# EAGLE design openDrive_MC_00.03 (EAGLE 5.10)
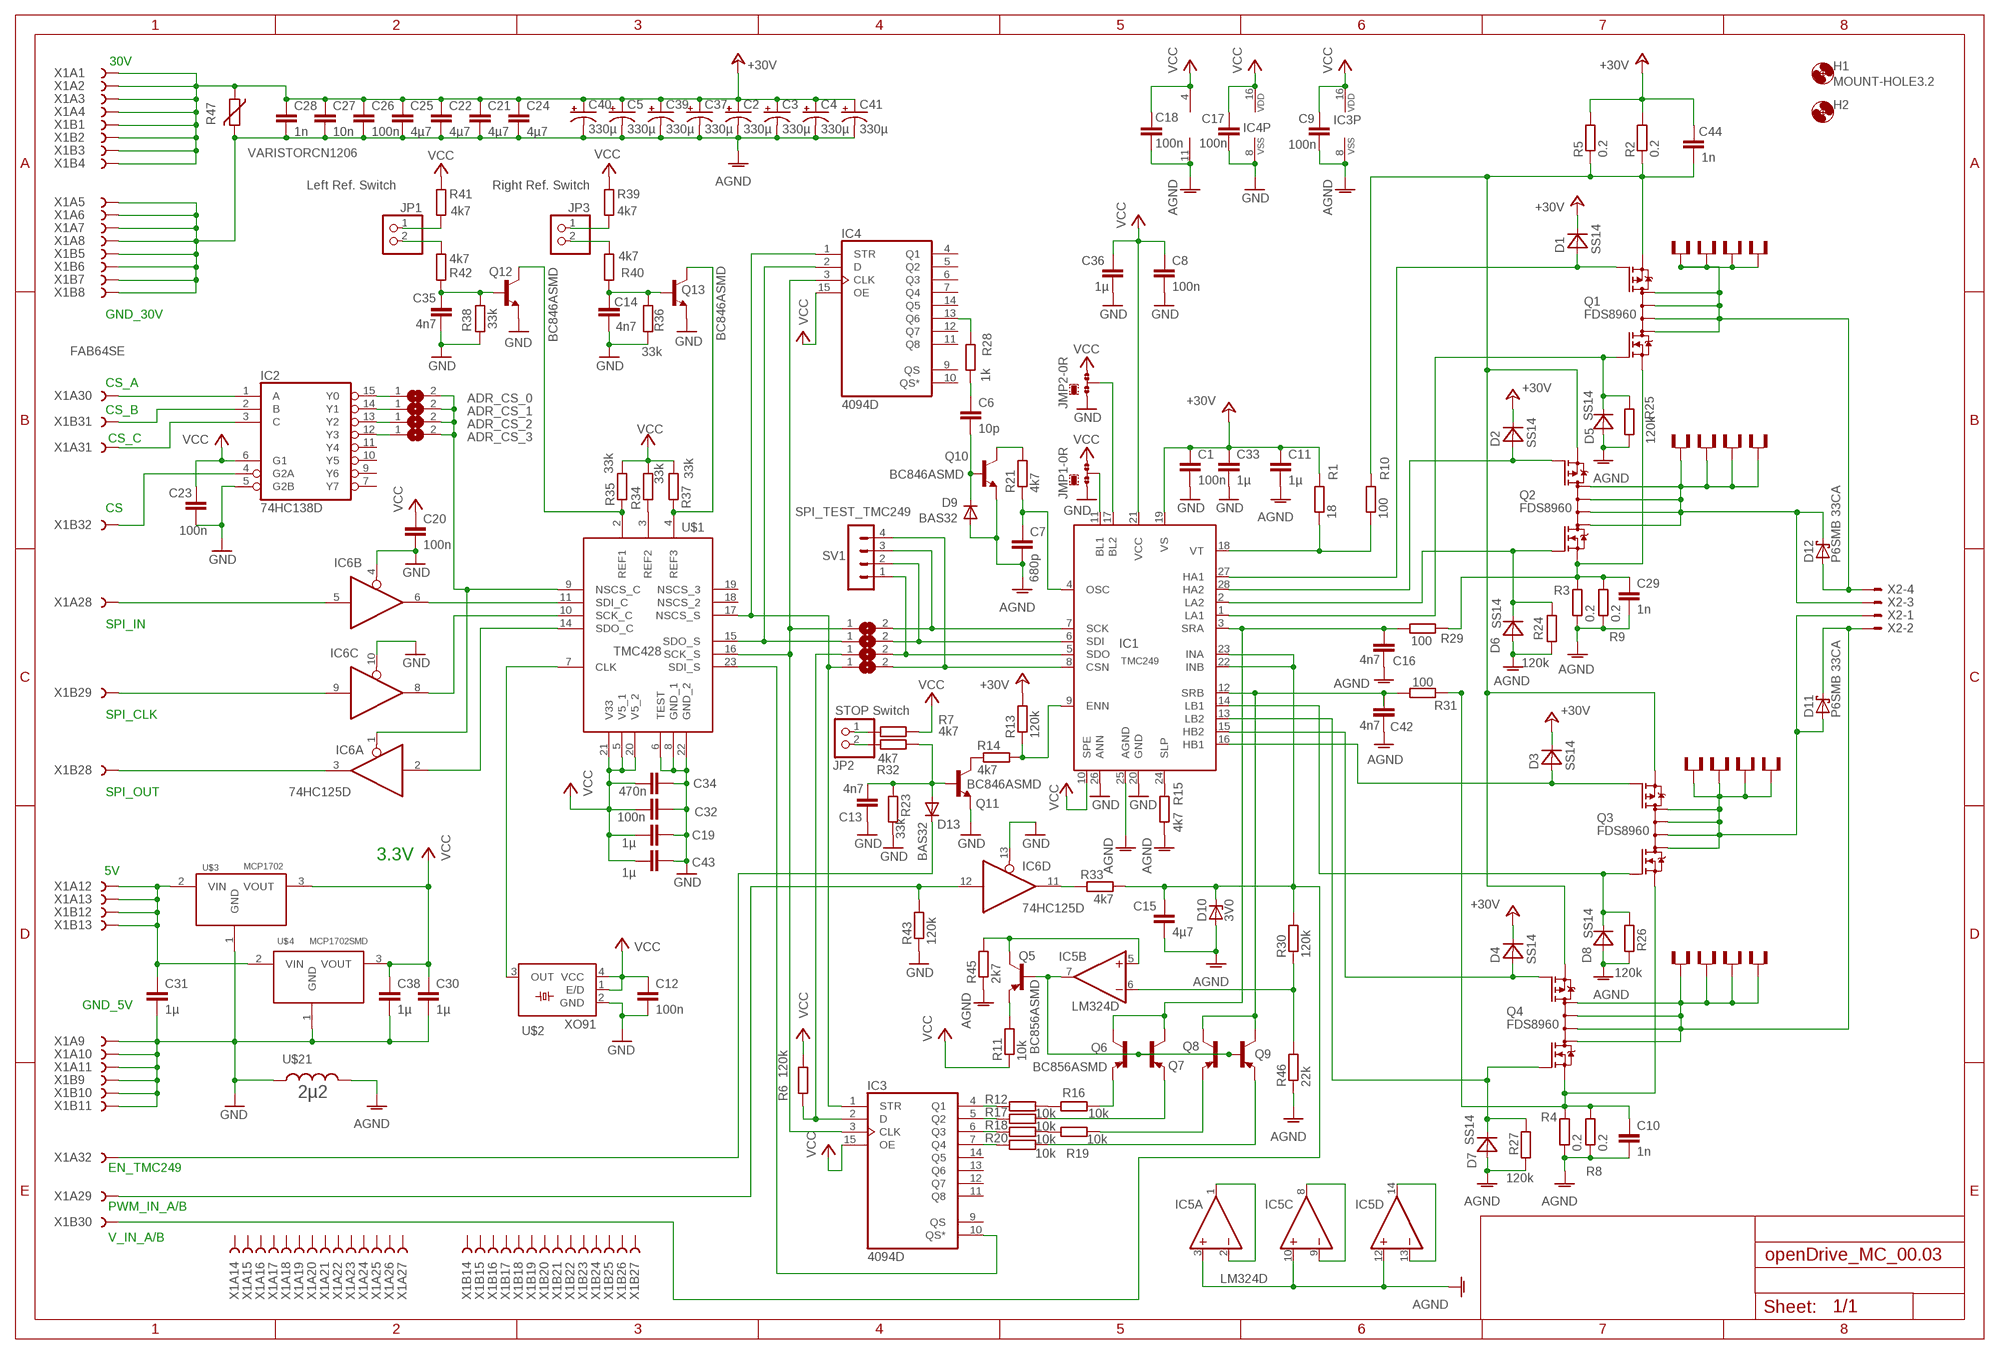
[diagram p0: schematic, sheet 1]

## Parts
C1  100n  C-EUC1206  [C1206]
C2  330µ  CAP_POLG  [PANASONIC_G]
C3  330µ  CAP_POLG  [PANASONIC_G]
C4  330µ  CAP_POLG  [PANASONIC_G]
C5  330µ  CAP_POLG  [PANASONIC_G]
C6  10p  C-EUC1206  [C1206]
C7  680p  C-EUC1206  [C1206]
C8  100n  C-EUC1206  [C1206]
C9  100n  C-EUC1206  [C1206]
C10  1n  C-EUC1206  [C1206]
C11  1µ  C-EUC1206  [C1206]
C12  100n  C-EUC1206  [C1206]
C13  4n7  C-EUC1206  [C1206]
C14  4n7  C-EUC1206  [C1206]
C15  4µ7  C-EUC1206  [C1206]
C16  4n7  C-EUC1206  [C1206]
C17  100n  C-EUC1206  [C1206]
C18  100n  C-EUC1206  [C1206]
C19  1µ  C-EUC1206  [C1206]
C20  100n  C-EUC1206  [C1206]
C21  4µ7  C-EUC1206  [C1206]
C22  4µ7  C-EUC1206  [C1206]
C23  100n  C-EUC1206  [C1206]
C24  4µ7  C-EUC1206  [C1206]
C25  4µ7  C-EUC1206  [C1206]
C26  100n  C-EUC1206  [C1206]
C27  10n  C-EUC1206  [C1206]
C28  1n  C-EUC1206  [C1206]
C29  1n  C-EUC1206  [C1206]
C30  1µ  C-EUC1206  [C1206]
C31  1µ  C-EUC1206  [C1206]
C32  100n  C-EUC1206  [C1206]
C33  1µ  C-EUC1206  [C1206]
C34  470n  C-EUC1206  [C1206]
C35  4n7  C-EUC1206  [C1206]
C36  1µ  C-EUC1206  [C1206]
C37  330µ  CAP_POLG  [PANASONIC_G]
C38  1µ  C-EUC1206  [C1206]
C39  330µ  CAP_POLG  [PANASONIC_G]
C40  330µ  CAP_POLG  [PANASONIC_G]
C41  330µ  CAP_POLG  [PANASONIC_G]
C42  4n7  C-EUC1206  [C1206]
C43  1µ  C-EUC1206  [C1206]
C44  1n  C-EUC1206  [C1206]
D1  SS14  MBRA340T3  [SMA]
D2  SS14  MBRA340T3  [SMA]
D3  SS14  MBRA340T3  [SMA]
D4  SS14  MBRA340T3  [SMA]
D5  SS14  MBRA340T3  [SMA]
D6  SS14  MBRA340T3  [SMA]
D7  SS14  MBRA340T3  [SMA]
D8  SS14  MBRA340T3  [SMA]
D9  BAS32  DIODE-SOD80C  [SOD80C]
D10  3V0  ZENER-DIODESOD80C  [SOD80C]
D11  P6SMB 33CA  MBRS130LT3  [SMB]
D12  P6SMB 33CA  MBRS130LT3  [SMB]
D13  BAS32  DIODE-SOD80C  [SOD80C]
H1  MOUNT-HOLE3.2  [3,2]
H2  MOUNT-HOLE3.2  [3,2]
IC1  TMC249  TMC239  [SO28W]
IC2  74HC138D  [SO16]
IC3  4094D  [SO16]
IC4  4094D  [SO16]
IC5  LM324D  [SO14]
IC6  74HC125D  [SO14]
JMP1  0R-JUMPB  [B0R-JMP]
JMP2  0R-JUMPB  [B0R-JMP]
JP1  Left Ref. Switch  PINHD-1X2  [1X02]
JP2  STOP Switch  PINHD-1X2  [1X02]
JP3  Right Ref. Switch  PINHD-1X2  [1X02]
Q1  FDS8960  IRF7389  [SO08-IRF]
Q2  FDS8960  IRF7389  [SO08-IRF]
Q3  FDS8960  IRF7389  [SO08-IRF]
Q4  FDS8960  IRF7389  [SO08-IRF]
Q5  BC856ASMD  [SOT23-BEC]
Q6  BC856ASMD  [SOT23-BEC]
Q7  BC856ASMD  [SOT23-BEC]
Q8  BC856ASMD  [SOT23-BEC]
Q9  BC856ASMD  [SOT23-BEC]
Q10  BC846ASMD  [SOT23]
Q11  BC846ASMD  [SOT23]
Q12  BC846ASMD  [SOT23]
Q13  BC846ASMD  [SOT23]
R1  18  R-EU_M1206  [M1206]
R2  0.2  R-EU_R2010  [R2010]
R3  0.2  R-EU_R2010  [R2010]
R4  0.2  R-EU_R2010  [R2010]
R5  0.2  R-EU_R2010  [R2010]
R6  120k  R-EU_M1206  [M1206]
R7  4k7  R-EU_M1206  [M1206]
R8  0.2  R-EU_R2010  [R2010]
R9  0.2  R-EU_R2010  [R2010]
R10  100  R-EU_M1206  [M1206]
R11  10k  R-EU_M1206  [M1206]
R12  10k  R-EU_M1206  [M1206]
R13  120k  R-EU_M1206  [M1206]
R14  4k7  R-EU_M1206  [M1206]
R15  4k7  R-EU_M1206  [M1206]
R16  10k  R-EU_M1206  [M1206]
R17  10k  R-EU_M1206  [M1206]
R18  10k  R-EU_M1206  [M1206]
R19  10k  R-EU_M1206  [M1206]
R20  10k  R-EU_M1206  [M1206]
R21  4k7  R-EU_M1206  [M1206]
R23  33k  R-EU_M1206  [M1206]
R24  120k  R-EU_M1206  [M1206]
R25  120k  R-EU_M1206  [M1206]
R26  120k  R-EU_M1206  [M1206]
R27  120k  R-EU_M1206  [M1206]
R28  1k  R-EU_M1206  [M1206]
R29  100  R-EU_M1206  [M1206]
R30  120k  R-EU_M1206  [M1206]
R31  100  R-EU_M1206  [M1206]
R32  4k7  R-EU_M1206  [M1206]
R33  4k7  R-EU_M1206  [M1206]
R34  33k  R-EU_M1206  [M1206]
R35  33k  R-EU_M1206  [M1206]
R36  33k  R-EU_M1206  [M1206]
R37  33k  R-EU_M1206  [M1206]
R38  33k  R-EU_M1206  [M1206]
R39  4k7  R-EU_M1206  [M1206]
R40  4k7  R-EU_M1206  [M1206]
R41  4k7  R-EU_M1206  [M1206]
R42  4k7  R-EU_M1206  [M1206]
R43  120k  R-EU_M1206  [M1206]
R45  2k7  R-EU_M1206  [M1206]
R46  22k  R-EU_M1206  [M1206]
R47  VARISTORCN1206  [CT/CN1206]
SJ1  ADR_CS_0  SJ  [SJ]
SJ2  ADR_CS_1  SJ  [SJ]
SJ3  ADR_CS_2  SJ  [SJ]
SJ4  ADR_CS_3  SJ  [SJ]
SJ5  SJ  [SJ]
SJ6  SJ  [SJ]
SJ7  SJ  [SJ]
SJ8  SJ  [SJ]
SV1  SPI_TEST_TMC249  MA04-1  [MA04-1]
U$1  TMC428  [SOP24]
U$2  XO91  [XO91]
U$3  MCP1702  [TO92]
U$4  MCP1702SMD  [SOT89]
U$5  PIN1  [PAD]
U$6  PIN1  [PAD]
U$7  PIN1  [PAD]
U$8  PIN1  [PAD]
U$9  PIN1  [PAD]
U$10  PIN1  [PAD]
U$11  PIN1  [PAD]
U$12  PIN1  [PAD]
U$13  PIN1  [PAD]
U$14  PIN1  [PAD]
U$15  PIN1  [PAD]
U$16  PIN1  [PAD]
U$17  PIN1  [PAD]
U$18  PIN1  [PAD]
U$19  PIN1  [PAD]
U$20  PIN1  [PAD]
U$21  2µ2  INDUCTOR1210  [1210]
X1  FAB64SE  [FAB64S]
X2  AKL18X-04W  [AKL182-04]

## Nets
+30V: C1.1 C2.+ C3.+ C4.+ C5.+ C11.1 C21.1 C22.1 C24.1 C25.1 C26.1 C27.1 C28.1 C33.1 C37.+ C39.+ C40.+ C41.+ C44.1 D1.C D2.C D3.C D4.C IC1.19(VS) R1.2 R2.2 R5.2 R13.2 R47.1 X1.A1 X1.A2 X1.A3 X1.A4 X1.B1 X1.B2 X1.B3 X1.B4
AGND: C2.- C3.- C4.- C5.- C7.2 C9.2 C10.2 C11.2 C15.2 C16.2 C18.2 C21.2 C22.2 C24.2 C25.2 C26.2 C27.2 C28.2 C29.2 C37.- C39.- C40.- C41.- C42.2 D5.A D6.A D7.A D8.A D9.A D10.A IC1.25(AGND) IC3.8(VSS) IC5.3(A:+IN) IC5.10(C:+IN) IC5.11(P:V-) IC5.12(D:+IN) Q10.2(E) R3.1 R4.1 R8.1 R9.1 R15.1 R24.1 R25.1 R26.1 R27.1 R45.1 R46.1 R47.2 U$21.2 X1.A5 X1.A6 X1.A7 X1.A8 X1.B5 X1.B6 X1.B7 X1.B8
GND: C1.2 C8.2 C12.2 C13.2 C14.2 C17.2 C19.2 C20.2 C23.2 C30.2 C31.2 C32.2 C33.2 C34.2 C35.2 C36.2 C38.2 C43.2 IC1.20(GND) IC1.26(ANN) IC2.5(G2B) IC4.8(VSS) IC6.4(B:OE) IC6.10(C:OE) IC6.13(D:OE) JMP1.3 JMP2.3 Q11.2(E) Q12.2(E) Q13.2(E) R23.1 R36.1 R38.1 R43.1 U$1.6(TEST) U$1.8(GND_1) U$1.22(GND_2) U$2.2(GND) U$3.1(GND) U$4.1(GND) U$21.1 X1.A9 X1.A10 X1.A11 X1.B9 X1.B10 X1.B11
N$1: D4.A IC1.15(HB2) Q4.4(P-G)
N$2: U$1.7(CLK) U$2.3(OUT)
N$3: D3.A IC1.16(HB1) Q3.4(P-G)
N$4: IC6.5(B:I) X1.A28
N$5: D11.C Q4.5(D) Q4.6(D) Q4.7(D) Q4.8(D) U$17.1 U$18.1 U$19.1 U$20.1 X2.P$2
N$6: C29.1 Q1.1(N-S) Q2.1(N-S) R3.2 R9.2 R29.2
N$7: D11.A Q3.5(D) Q3.6(D) Q3.7(D) Q3.8(D) U$13.1 U$14.1 U$15.1 U$16.1 X2.P$1
N$8: D2.A IC1.28(HA2) Q2.4(P-G)
N$9: D12.C Q2.5(D) Q2.6(D) Q2.7(D) Q2.8(D) U$9.1 U$10.1 U$11.1 U$12.1 X2.P$3
N$10: D5.C IC1.1(LA1) Q1.2(N-G) R25.2
N$11: D1.A IC1.27(HA1) Q1.4(P-G)
N$12: D12.A Q1.5(D) Q1.6(D) Q1.7(D) Q1.8(D) U$5.1 U$6.1 U$7.1 U$8.1 X2.P$4
N$13: D6.C IC1.2(LA2) Q2.2(N-G) R24.2
N$14: C7.1 IC1.4(OSC) R21.1
N$15: D7.C IC1.13(LB2) Q4.2(N-G) R27.2
N$16: C15.1 D10.C IC1.22(INB) IC1.23(INA) R30.2 R33.2 X1.B30
N$17: IC1.18(VT) R1.1 R10.1
N$18: IC5.6(B:-IN) R30.1 R46.2
N$19: IC1.7(SCK) SJ5.2 SV1.3
N$20: C16.1 IC1.3(SRA) Q6.C Q7.C R29.1
N$21: Q6.E R16.2
N$22: C42.1 IC1.12(SRB) Q8.C Q9.C R31.1
N$23: Q7.E R17.2
N$24: IC1.11(BL1) JMP1.2
N$25: IC5.7(B:OUT) Q5.B Q6.B Q7.B Q8.B Q9.B
N$26: Q8.E R19.2
N$27: Q9.E R20.2
N$28: IC1.24(SLP) R15.2
N$29: R12.2 R16.1
N$30: R18.2 R19.1
N$31: IC3.4(Q1) R12.1
N$32: IC3.5(Q2) R17.1
N$33: IC3.6(Q3) R18.1
N$34: IC3.7(Q4) R20.1
N$35: IC4.2(D) SJ6.1 U$1.15(SDO_S)
N$36: IC3.3(CLK) IC4.3(CLK) SJ5.1 U$1.16(SCK_S)
N$37: IC3.1(STR) IC4.1(STR) SJ8.1 U$1.17(NSCS_S)
N$38: IC3.10(QS*) U$1.23(SDI_S)
N$39: IC3.2(D) R6.1 SJ7.1
N$40: IC1.17(BL2) JMP2.2
N$41: IC6.9(C:I) X1.B29
N$42: C44.2 Q1.3(P-S) Q2.3(P-S) Q3.3(P-S) Q4.3(P-S) R2.1 R5.1 R10.2
N$43: JP2.1 R7.1
N$44: JP2.2 R32.2
N$45: D8.C IC1.14(LB1) Q3.2(N-G) R26.2
N$46: IC6.2(A:I) U$1.14(SDO_C)
N$47: Q10.3(C) R21.2
N$48: Q11.3(C) R14.1
N$49: C6.2 D9.C Q10.1(B)
N$50: IC5.1(A:OUT) IC5.2(A:-IN)
N$51: IC4.13(Q6) R28.2
N$52: C6.1 R28.1
N$53: IC5.8(C:OUT) IC5.9(C:-IN)
N$54: IC5.13(D:-IN) IC5.14(D:OUT)
N$55: IC6.11(D:O) R33.1
N$56: IC1.9(ENN) R13.1 R14.2
N$57: IC5.5(B:+IN) Q5.C R45.2
N$58: IC6.8(C:O) U$1.10(SCK_C)
N$59: Q5.E R11.2
N$60: IC6.6(B:O) U$1.11(SDI_C)
N$61: IC6.1(A:OE) SJ1.2 SJ2.2 SJ3.2 SJ4.2 U$1.9(NSCS_C)
N$62: IC2.15(Y0) SJ1.1
N$63: IC2.14(Y1) SJ2.1
N$64: IC2.13(Y2) SJ3.1
N$65: IC2.12(Y3) SJ4.1
N$66: IC2.2(B) X1.B31
N$67: IC2.4(G2A) X1.B32
N$68: IC2.3(C) X1.A31
N$69: IC2.1(A) X1.A30
N$72: IC6.3(A:O) X1.B28
N$73: IC6.12(D:I) R43.2 X1.A29
N$74: C13.1 D13.A Q11.1(B) R23.2 R32.1
N$75: C31.1 U$3.2(VIN) U$4.2(VIN) X1.A12 X1.A13 X1.B12 X1.B13
N$76: D13.C X1.A32
N$77: Q12.3(C) R35.1 U$1.2(REF1)
N$78: R34.1 U$1.3(REF2)
N$79: Q13.3(C) R37.1 U$1.4(REF3)
N$82: C35.1 Q12.1(B) R38.2 R42.1
N$83: JP1.2 R42.2
N$84: JP1.1 R41.1
N$85: C14.1 Q13.1(B) R36.2 R40.1
N$86: JP3.2 R40.2
N$87: JP3.1 R39.1
N$88: IC1.6(SDI) SJ6.2 SV1.2
N$89: IC1.5(SDO) SJ7.2 SV1.1
N$90: IC1.8(CSN) SJ8.2 SV1.4
N$91: C10.1 Q3.1(N-S) Q4.1(N-S) R4.2 R8.2 R31.2
VCC: C8.1 C9.1 C12.1 C17.1 C18.1 C19.1 C20.1 C23.1 C30.1 C32.1 C34.1 C36.1 C38.1 C43.1 IC1.10(SPE) IC1.21(VCC) IC2.6(G1) IC3.15(OE) IC3.16(VDD) IC4.15(OE) IC4.16(VDD) IC5.4(P:V+) JMP1.1 JMP2.1 R6.2 R7.2 R11.1 R34.2 R35.2 R37.2 R39.2 R41.2 U$1.5(V5_1) U$1.20(V5_2) U$1.21(V33) U$2.1(E/D) U$2.4(VCC) U$3.3(VOUT) U$4.3(VOUT)
Unconnected: IC2.7(Y7) IC2.9(Y6) IC2.10(Y5) IC2.11(Y4) IC3.9(QS) IC3.11(Q8) IC3.12(Q7) IC3.13(Q6) IC3.14(Q5) IC4.4(Q1) IC4.5(Q2) IC4.6(Q3) IC4.7(Q4) IC4.9(QS) IC4.10(QS*) IC4.11(Q8) IC4.12(Q7) IC4.14(Q5) U$1.18(NSCS_2) U$1.19(NSCS_3) X1.A14 X1.A15 X1.A16 X1.A17 X1.A18 X1.A19 X1.A20 X1.A21 X1.A22 X1.A23 X1.A24 X1.A25 X1.A26 X1.A27 X1.B14 X1.B15 X1.B16 X1.B17 X1.B18 X1.B19 X1.B20 X1.B21 X1.B22 X1.B23 X1.B24 X1.B25 X1.B26 X1.B27

## Notes on the sheet
- 30V
- GND_30V
- CS_A
- CS_B
- CS_C
- CS
- SPI_IN
- SPI_CLK
- SPI_OUT
- 3.3V
- 5V
- GND_5V
- EN_TMC249
- PWM_IN_A/B
- V_IN_A/B

## Power pins joined to a net without a drawn wire
GND: IC2.8(GND) IC6.7(P:GND)
VCC: IC2.16(VCC) IC6.14(P:VCC)

## Library data of the parts
C1 C6-C36 C38 C42-C44 = rcl:C-EU: CAPACITOR, European symbol
C2-C5 C37 C39-C41 = SparkFun:CAP_POL: Capacitor Polarized These are standard SMD and PTH capacitors. Normally 10uF, 47uF, and 100uF in electrolytic and tantalum varieties. Always verify the external diameter of the through hole cap, it varies with capacity, voltage, and manufacturer. The EIA devices should be standard.
D1-D8 = diode:MBRA340T3: Surface Mount Schottky Power Rectifier Source: http://www.onsemi.com/pub_link/Collateral/MBRA340T3-D.PDF
D9 D13 = diode:DIODE-: DIODE
D10 = diode:ZENER-DIODE: Z-Diode
D11 D12 = diode:MBRS130LT3: Schottky Power Rectifier Source: http://www.onsemi.com/pub/Collateral/MBRS130LT3-D.PDF
H1 H2 = holes:MOUNT-HOLE: MOUNTING HOLE with drill center marker
IC1 = tmc:TMC239: TMC239 Stepper Motor Driver - up to 4A, w. protection and diagnostics
IC2 = 74xx-eu:74*138: 3-line to 8-line DECODER/DEMULTIPLEXER
IC3 IC4 = 40xx:4094: 8-stage SHIFT/STORE REGISTER, tri-state
IC5 = linear:LM324: OP AMP
IC6 = 74xx-eu:74*125: Quad bus BUFFER, 3-state
JMP1 JMP2 = jump-0r-smd:0R-JUMP: SMD 0R 0805 Jumper
JP1-JP3 = pinhead:PINHD-1X2: PIN HEADER
Q1-Q4 = transistor-fet:IRF7389: Complimentary Half Bridge HEXFET Power MOSFET Source: http://www.irf.com/product-info/datasheets/data/irf7389.pdf
Q5-Q9 = transistor-pnp:BC856*: PNP Transistror
Q10-Q13 = transistor-npn:BC846*: NPN Transistor
R1-R21 R23-R43 R45 R46 = rcl:R-EU_: RESISTOR, European symbol
R47 = varistor:VARISTOR: VARISTOR
SJ1-SJ8 = jumper:SJ: SMD solder JUMPER
SV1 = con-lstb:MA04-1: PIN HEADER
U$1 = tmc428:TMC428
U$2 = euroquartz:XO91
U$3 U$4 = mcp1702:MCP1702
U$5-U$20 = con-faston:PIN1
U$21 = SparkFun:INDUCTOR: Inductors Basic Inductor/Choke - 0603 and 1206. Footprints are not proven and vary greatly between part numbers.
X1 = con-vg:FAB64SE: CONNECTOR female, 64 pins, single, type B, rows AB, grid 2.54 mm
X2 = con-riacon_akl:AKL18X-04: Riacon AKL18X Steckverbinder 4-Pol Grid = 3,5mm

## Board
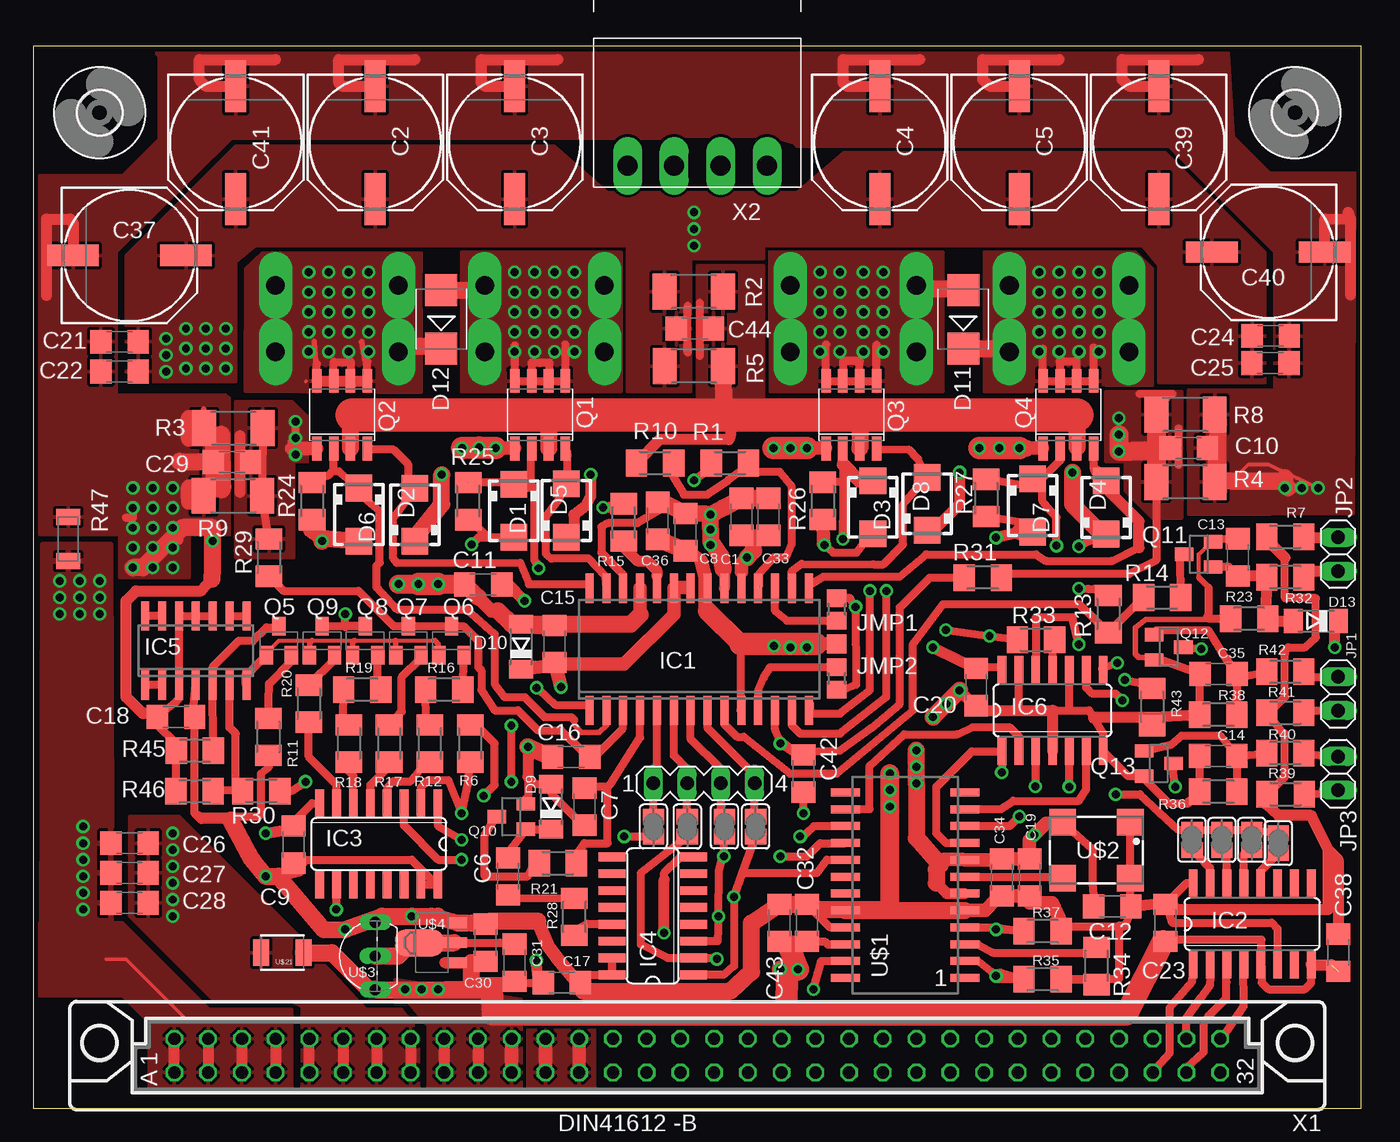
[diagram p1: board, top side]
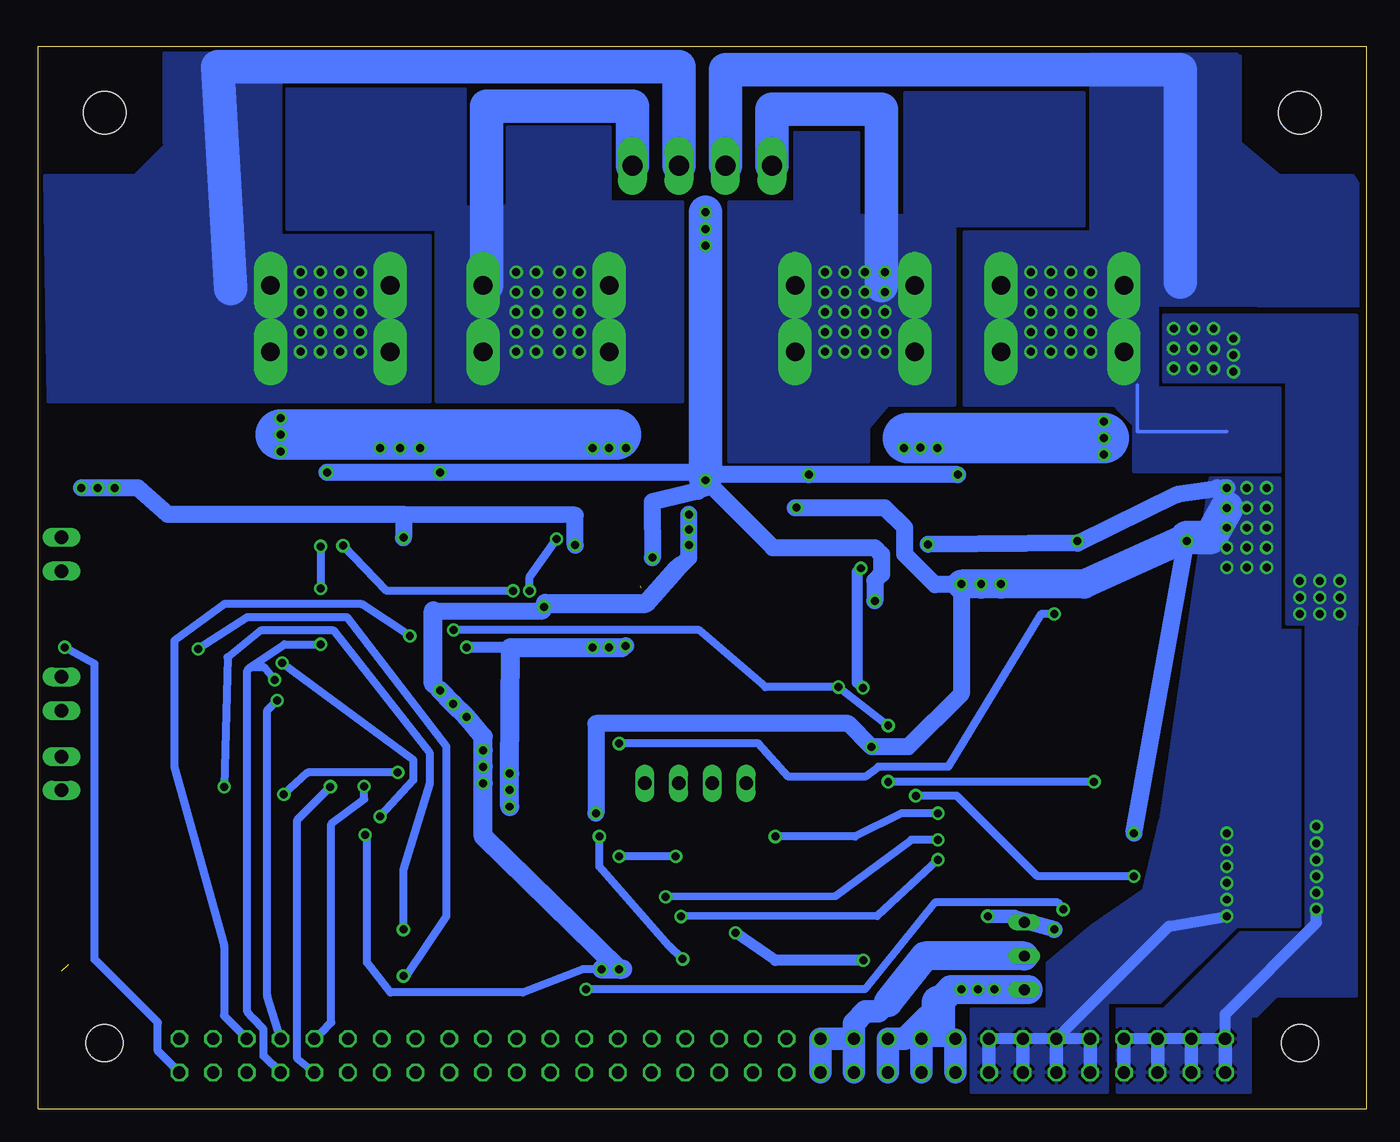
[diagram p2: board, bottom side, seen from below]

Size 100 x 80 mm. Coordinates in mm from the lower left corner, seen from the top.
Outline: 100,0 100,80 0,80 0,0 100,0
Copper layers (1*16): Top 0.035mm / dielectric 1.5mm / Bottom 0.035mm
Design rules "ZWILLING": minimum track width 0.2mm, minimum drill 0.5mm, track to track 0.2mm, track to pad 0.2mm, pad to pad 0.15mm, via to via 0.2mm, smd to smd 0mil, copper to edge 0.2mm, drill to drill 0.2mm, minimum pad ring 0.2mm, minimum via ring 0.2mm, stop-mask expansion 0.1mm, vias tented up to drill 0mil, thermal gap 10mil

### Footprints (pad centres in the part's own frame; a part is rotated, then mirrored left to right if it is on the bottom)
C1206 = smd 1.6 x 1.8: 1 -1.4,0; 2 1.4,0
PANASONIC_G = smd 3.9 x 1.6: + 4.25,0; - -4.25,0
SMA = smd 2 x 2: A 2,0; C -2,0
SOD80C = smd 1.4 x 1.8: A 1.7,0; C -1.7,0
SMB = smd 2.4 x 2.4: A 2.2,0; C -2.2,0
3,2 = hole 3.2: 0,0
SO28W = smd 0.6 x 2.2: 1 -8.255,-4.6; 2 -6.985,-4.6; 3 -5.715,-4.6; 4 -4.445,-4.6; 5 -3.175,-4.6; 6 -1.905,-4.6; 7 -0.635,-4.6; 8 0.635,-4.6; 9 1.905,-4.6; 10 3.175,-4.6; 11 4.445,-4.6; 12 5.715,-4.6; 13 6.985,-4.6; 14 8.255,-4.6; 15 8.255,4.6; 16 6.985,4.6; 17 5.715,4.6; 18 4.445,4.6; 19 3.175,4.6; 20 1.905,4.6; 21 0.635,4.6; 22 -0.635,4.6; 23 -1.905,4.6; 24 -3.175,4.6; 25 -4.445,4.6; 26 -5.715,4.6; 27 -6.985,4.6; 28 -8.255,4.6
SO16 = smd 0.66 x 2.032: 1 -4.445,-3.073; 2 -3.175,-3.073; 3 -1.905,-3.073; 4 -0.635,-3.073; 5 0.635,-3.073; 6 1.905,-3.073; 7 3.175,-3.073; 8 4.445,-3.073; 9 4.445,3.073; 10 3.175,3.073; 11 1.905,3.073; 12 0.635,3.073; 13 -0.635,3.073; 14 -1.905,3.073; 15 -3.175,3.073; 16 -4.445,3.073
SO14 = smd 0.6 x 2.2: 1 -3.81,-2.6; 2 -2.54,-2.6; 3 -1.27,-2.6; 4 0,-2.6; 5 1.27,-2.6; 6 2.54,-2.6; 7 3.81,-2.6; 8 3.81,2.6; 9 2.54,2.6; 10 1.27,2.6; 11 0,2.6; 12 -1.27,2.6; 13 -2.54,2.6; 14 -3.81,2.6
SO14' = smd 0.66 x 2.032: 1 -3.81,-3.073; 2 -2.54,-3.073; 3 -1.27,-3.073; 4 0,-3.073; 5 1.27,-3.073; 6 2.54,-3.073; 7 3.81,-3.073; 8 3.81,3.073; 9 2.54,3.073; 10 1.27,3.073; 11 0,3.073; 12 -1.27,3.073; 13 -2.54,3.073; 14 -3.81,3.073
B0R-JMP = smd 1.5 x 1.3: 1 0,1.7; 2 0,0; 3 0,-1.7
1X02 = drill 1.016 long: 1 -1.27,0; 2 1.27,0
SO08-IRF = smd 0.72 x 1.78: 1 -1.905,-2.543; 2 -0.635,-2.543; 3 0.635,-2.543; 4 1.905,-2.543; 5 1.905,2.543; 6 0.635,2.543; 7 -0.635,2.543; 8 -1.905,2.543
SOT23-BEC = smd 1 x 1.4: B -0.95,-1.1; C 0,1.1; E 0.95,-1.1
SOT23 = smd 1 x 1.4: 1 -0.95,-1.1; 2 0.95,-1.1; 3 0,1.1
M1206 = smd 1.6 x 2: 1 -1.4,0; 2 1.4,0
R2010 = smd 1.8 x 2.7: 1 -2.2,0; 2 2.2,0
CT/CN1206 = smd 1.2 x 1.8: 1 -1.65,0; 2 1.65,0
SJ = smd 1.168 x 1.6: 1 -0.762,0; 2 0.762,0
MA04-1 = drill 1.016 long: 1 -3.81,0; 2 -1.27,0; 3 1.27,0; 4 3.81,0
SOP24 = smd 0.6 x 2.2: 1 -6.985,-4.5; 2 -5.715,-4.5; 3 -4.445,-4.5; 4 -3.175,-4.5; 5 -1.905,-4.5; 6 -0.635,-4.5; 7 0.635,-4.5; 8 1.905,-4.5; 9 3.175,-4.5; 10 4.445,-4.5; 11 5.715,-4.5; 12 6.985,-4.5; 13 6.985,4.5; 14 5.715,4.5; 15 4.445,4.5; 16 3.175,4.5; 17 1.905,4.5; 18 0.635,4.5; 19 -0.635,4.5; 20 -1.905,4.5; 21 -3.175,4.5; 22 -4.445,4.5; 23 -5.715,4.5; 24 -6.985,4.5
XO91 = smd 2 x 2: 1 -2.61,-2.07; 2 2.49,-2.07; 3 2.49,2.13; 4 -2.61,2.13
TO92 = drill 0.813 long: 1 -2.54,0; 2 0,0; 3 2.54,0
SOT89 = smd 0.8 x 1.4: 1 -1.499,-1.981; 3 1.499,-1.981 | smd 0.8 x 1.9: 2 0,-1.727 | smd 2.032 x 3.65: C@1 0,0.94
PAD = drill 1.4 pad 2.54 long: 1 0,0
1210 = smd 1.2 x 2: 1 -1.6,0; 2 1.6,0
FAB64S = drill 0.914 octagon: A1 -1.27,39.37; A2 -1.27,36.83; A3 -1.27,34.29; A4 -1.27,31.75; A5 -1.27,29.21; A6 -1.27,26.67; A7 -1.27,24.13; A8 -1.27,21.59; A9 -1.27,19.05; A10 -1.27,16.51; A11 -1.27,13.97; A12 -1.27,11.43; A13 -1.27,8.89; A14 -1.27,6.35; A15 -1.27,3.81; A16 -1.27,1.27; A17 -1.27,-1.27; A18 -1.27,-3.81; A19 -1.27,-6.35; A20 -1.27,-8.89; A21 -1.27,-11.43; A22 -1.27,-13.97; A23 -1.27,-16.51; A24 -1.27,-19.05; A25 -1.27,-21.59; A26 -1.27,-24.13; A27 -1.27,-26.67; A28 -1.27,-29.21; A29 -1.27,-31.75; A30 -1.27,-34.29; A31 -1.27,-36.83; A32 -1.27,-39.37; B1 1.27,39.37; B2 1.27,36.83; B3 1.27,34.29; B4 1.27,31.75; B5 1.27,29.21; B6 1.27,26.67; B7 1.27,24.13; B8 1.27,21.59; B9 1.27,19.05; B10 1.27,16.51; B11 1.27,13.97; B12 1.27,11.43; B13 1.27,8.89; B14 1.27,6.35; B15 1.27,3.81; B16 1.27,1.27; B17 1.27,-1.27; B18 1.27,-3.81; B19 1.27,-6.35; B20 1.27,-8.89; B21 1.27,-11.43; B22 1.27,-13.97; B23 1.27,-16.51; B24 1.27,-19.05; B25 1.27,-21.59; B26 1.27,-24.13; B27 1.27,-26.67; B28 1.27,-29.21; B29 1.27,-31.75; B30 1.27,-34.29; B31 1.27,-36.83; B32 1.27,-39.37 | hole 2.794: 0.965,-45.009; 0.965,45.009
AKL182-04 = drill 1.5 pad 2.184 long: P$1 -5.25,0; P$2 -1.75,0; P$3 1.75,0; P$4 5.25,0

### Placement (x,y rotation side)
C1  53.33,44.58 90 top
C2  25.75,72.75 270 top
C3  36.25,72.75 270 top
C4  63.75,72.75 270 top
C5  74.25,72.75 270 top
C6  35.75,17.5 90 top
C7  41.5,22.75 270 top
C8  49.12,43.42 90 top
C9  19.6,19.9 90 top
C10  87,49.75 0 top
C11  33.88,39.48 180 top
C12  81.25,15.25 180 top
C13  90.7,41.52 90 top
C14  89.22,26.57 180 top
C15  39.25,35 90 top
C16  40.5,26.5 180 top
C17  39.8,9.5 180 top
C18  10.75,29.5 180 top
C19  75.03,17.43 90 top
C20  71,31.75 270 top
C21  6.5,57.75 180 top
C22  6.5,55.5 180 top
C23  85.25,14 270 top
C24  93.17,58.2 0 top
C25  93.15,56.15 0 top
C26  7.25,20 0 top
C27  7.25,17.75 0 top
C28  7.25,15.5 0 top
C29  14.97,48.7 180 top
C30  34.08,12.5 270 top
C31  36.25,11 270 top
C32  58.25,14 270 top
C33  55.38,44.58 90 top
C34  72.92,17.43 90 top
C35  89.25,32.75 180 top
C36  47.02,44.27 90 top
C37  7.25,64.25 0 top
C38  98.25,11.75 270 top
C39  84.75,72.75 270 top
C40  93,64.5 180 top
C41  15.25,72.75 270 top
C42  58,25.25 270 top
C43  56.17,14 270 top
C44  49.83,58.75 0 top
D1  40.13,45.05 90 top
D2  28.72,44.72 90 top
D3  67.31,45.56 90 top
D4  80.79,45.28 90 top
D5  36.19,45.03 270 top
D6  24.51,44.74 270 top
D7  75.26,45.43 270 top
D8  63.23,45.28 270 top
D9  39,22.75 90 top
D10  36.73,34.8 90 top
D11  70.03,59.45 90 top
D12  30.73,59.45 90 top
D13  96.58,36.73 180 top
H1  5,75 0 top
H2  95,75 0 top
IC1  50.14,34.6 0 top
IC2  91.78,13.92 0 top
IC3  26.02,19.94 180 top
IC4  46.65,14.53 90 top
IC5  12.25,34.5 0 top
IC6  74HC125D  [SO14']  76.75,30 0 top
JMP1  60.5,33.25 0 top
JMP2  60.5,36.75 180 top
JP1  98.25,31.25 90 top
JP2  98.25,41.75 270 top
JP3  98.25,25.25 90 top
Q1  38.17,52.26 0 top
Q2  23.26,52.26 0 top
Q3  61.6,52.26 0 top
Q4  77.94,52.26 0 top
Q5  18.5,35.25 0 top
Q6  31.5,35.25 0 top
Q7  28.25,35.25 0 top
Q8  25,35.25 0 top
Q9  21.75,35.25 0 top
Q10  36,22 90 top
Q11  87.75,41.75 90 top
Q12  85.5,34.75 270 top
Q13  84.75,26 270 top
R1  52.45,48.62 180 top
R2  49.74,61.52 180 top
R3  15.07,51.24 0 top
R4  86.75,47.19 180 top
R5  49.75,55.92 180 top
R6  32.9,27.5 90 top
R7  94.28,43.08 180 top
R8  86.75,52.27 180 top
R9  15.04,46.16 0 top
R10  46.83,48.62 180 top
R11  17.7,28 90 top
R12  29.85,27.5 90 top
R13  80.95,37.25 90 top
R14  85,38.5 180 top
R15  44.48,44.15 270 top
R16  30.95,31.55 0 top
R17  26.8,27.5 90 top
R18  23.77,27.5 90 top
R19  24.77,31.55 0 top
R20  20.75,30.5 90 top
R21  39.5,18.5 180 top
R23  91.55,36.9 0 top
R24  21,45.75 90 top
R25  32.75,45.75 90 top
R26  59.45,45.77 90 top
R27  71.75,46 90 top
R28  40.75,14.45 270 top
R29  17.75,41.5 90 top
R30  17.18,23.93 0 top
R31  71.5,40 0 top
R32  94.28,40.02 0 top
R33  75.5,35.33 180 top
R34  80.08,10.75 270 top
R35  76,9.75 0 top
R36  89.22,23.88 0 top
R37  76,13.38 0 top
R38  89.22,29.68 0 top
R39  94.3,23.7 180 top
R40  94.28,26.77 0 top
R41  94.28,29.82 180 top
R42  94.28,32.9 0 top
R43  84.25,30.25 90 top
R45  12.18,26.95 0 top
R46  12.15,23.9 0 top
R47  2.65,42.9 90 top
SJ1  87.25,20.25 90 top
SJ2  89.5,20.25 90 top
SJ3  91.75,20.25 90 top
SJ4  93.75,20 90 top
SJ5  52.05,21.25 90 top
SJ6  49.25,21.25 90 top
SJ7  46.7,21.25 90 top
SJ8  54.4,21.25 90 top
SV1  50.5,24.5 0 top
U$1  65.65,16.84 90 top
U$2  80,19.5 180 top
U$3  25.75,11.5 90 top
U$4  30,12.5 90 top
U$5  43,62 90 top
U$6  43,57 90 top
U$7  34,62 90 top
U$8  34,57 90 top
U$9  27.5,57 90 top
U$10  18.25,57 90 top
U$11  27.5,62 90 top
U$12  18.25,62 90 top
U$13  57,57 90 top
U$14  57,62 90 top
U$15  66.5,62 90 top
U$16  66.5,57 90 top
U$17  73.5,62 90 top
U$18  73.5,57 90 top
U$19  82.5,57 90 top
U$20  82.5,62 90 top
U$21  18.75,11.75 180 top
X1  50,4 90 top
X2  50,71 180 top

### Tracks (layer width: path | path; a pad name or v marks a point on that pad's centre or on a via)
+30V  (via drill 0.6)
  Top 0.254: 5.5,11.25 7,11.25 11.5,6.75
  Top 0.305: 40.72,42.97 D1.C
  Top 0.61: 53.31,40.41 IC1.19 | D4.C v78.72,42.35 | R13.2 79.92,39.15 79.42,39.15 v78.72,39.17 | 49.27,56.98 49.27,60.48 | R1.2 50.88,48.12 v49.75,47.33
  Top 0.813: 67.5,43.75 68,43.75 69.75,45.5 v69.75,47.92 | X1.A1 X1.B1 | X1.B2 X1.A2 | X1.B3 X1.A3 | X1.B4 X1.A4 | 40.72,42.97 40.72,44.72 40.75,44.75 41.58,45.38 41.98,46.12 v41.98,47.75 | C11.1 35.77,39.48 v37,38.25
  Top 1.016: 53.31,40.41 53.31,41.06 v53.75,41.5 | 53.88,41.62 54.25,42
  Top 1.27: 67.5,43.75 D3.C | D4.C 80.47,43.28 78.25,45.5 v78.25,47.92 | D2.C 28.72,42.97 30.75,45.5 v30.75,47.75 | 54.25,42.98 C1.1 | 54.25,42.98 C33.1 | 54.25,42 54.25,42.98 | v53.75,41.5 53.88,41.62
  Bottom 0.254: 49.25,47.75 v49.75,47.33 49.75,47.75
  Bottom 0.61: v78.72,42.35 v78.72,39.17 | v49.75,47.33 49.5,47.5
  Bottom 0.813: v3.75,15 3.75,14 10.63,7.12 X1.B1 X1.B2 X1.B3 X1.B4
  Bottom 1.016: X1.A1 X1.B1 | X1.B2 X1.A2 | X1.B3 X1.A3 | X1.B4 X1.A4
  Bottom 1.27: 49.75,47.92 v69.75,47.92 v78.25,47.92 | 49.25,47.75 v41.98,47.75 v30.75,47.75 | v49.75,47.33 49.75,47.5 | v49.75,47.33 49.75,46.75 50.3,46.5 53.77,45.7 v53.75,41.5 | v37,38.25 37,39.75 36.5,40.25 36.5,41.75 37,42.25 44.67,42.25 v49.75,47.33
  Bottom 2.54: 49.75,47.5 49.75,47.75 49.75,47.92 v49.75,65 v49.75,66.25 v49.75,67.5
  other vias: 14.5,55.75 13,55.75 14.5,58.75 14.5,57.25 13,57.25 13,58.75 11.5,58.75 11.5,55.75 11.5,57.25 2,39.75 3.5,39.75 5,39.75 2,38.5 3.5,38.5 5,38.5 2,37.25 3.5,37.25 5,37.25 3.75,21.25 3.75,20 3.75,18.75 3.75,17.5 3.75,16.25 10,55.5 10,56.75 10,58
  pour Top: 5.85,42.5 5.9,21.1 5.88,10.55 0.65,10.7 0.7,42.5
  pour Top: 48.25,69 57.5,69 61,72 85.25,72 92.75,64.5 92.75,54.67 84.75,54.67 84.75,63.5 83.5,65 48.25,65
  pour Top: 48.75,66 48.75,69 43.25,69 39.25,72.5 15.25,72.5 7,64.25 7,54.75 15.25,54.75 15.25,63.75 16.75,65 48.5,65
  pour Bottom: 0.7,36.48 0.7,59.73 15.25,59.75 15.25,54.75 6,54.75 6,36.5
  pour Top: 44.75,54 44.75,67.25 54.75,67.25 55,66 55,64 49.5,64 49.5,54
  pour Bottom: 0.75,12 0.75,36.75 4.5,36.75 4.5,12
  pour Top: 8.75,1.25 8.75,7.5 19.48,7.5 19.48,1.25
  pour Bottom: 8.75,1.25 8.75,7.5 18.75,7.5 18.75,1.25
  pour Bottom: 0.75,11 0.75,13.25 9.5,13.25 15.75,7 8.25,7 6.75,8.5 0.75,8.5
  pour Top: 0.5,11.75 0.5,8.5 6.75,8.5 8.5,6.75 13.75,6.75 13.75,7 6.75,14 0.5,14
AGND  (via drill 0.6)
  Top 0.254: C29.2 13.57,47.6 14.17,47 | 12.85,52.67 12.85,52.09 12.75,52 11.75,52 | R9.1 11.96,46.2 11.75,46 | v96.75,46.75 93,48.5 91.5,48.5 90.25,47.25
  Top 0.406: 12.85,52.67 R3.1
  Top 0.61: IC5.3 IC5.12 IC5.11 IC5.10 | IC5.3 11,31.88 | IC5.3 10.98,30.88 10.73,30.63 C18.2 | R46.1 R45.1 10.75,27.5 9.35,28.9 C18.2 | R27.1 74.59,44.1 D7.A | D8.A 63.03,43.28 62,41.88 60.25,41.88 59.5,42.58 | R26.1 59.55,42.73 v59.58,42.45 | R25.1 32.9,44.35 34.25,43 36.16,43 D5.A 33.53,43.03 v33,42.5 | R15.1 45.15,45.15 | C18.2 9.25,29.75 | 7,44.5 7.5,44.5 v7.5,45.25 | 39,26.5 C16.2 | C9.2 19.6,21.6 21,23 IC3.8 | R24.1 20.5,43.75 20.75,43.5 | Q10.2 37.1,23.35 37.25,23.5 37.25,25 37.8,24.45 D9.A 39,23.75 41.4,21.35 C7.2 | v58,22.25 C42.2 | 13.5,50.5 13.25,50.5 13.25,48.75 13.25,46.75
  Top 0.813: v21.75,42.75 20.75,43.5 | D7.A 74.18,43.43 v72.5,43 | 19.6,21.6 19.6,21.1 v17.5,20.75 | D9.A 39.05,24.45 | v37.25,27.25 37.25,25 | X1.A5 X1.B5 | X1.B6 X1.A6 | X1.B7 X1.A7 | X1.B8 X1.A8 | 13.47,39.89 12.65,39 7.75,39 7,38.25 7,31 8.25,29.75 9.1,29.75 C18.2 | 10.89,42.86 v10.5,43.75 | 99.17,67.03 99.17,61.27 | 99.17,67.03 99,67.5 | C40.- 97.25,67 99.17,67.03 | 87.75,79 82,79 82,77.5 82.5,77 C39.- | 77.25,79 71.5,79 71.5,77.5 72,77 C5.- | 66.75,79 61,79 61,77.25 61.25,77 C4.- | 39.5,79 33.75,79 33.75,77.25 34,77 C3.- | 28.75,79 23,79 23,77.25 23.25,77 C2.- | 18.25,79 12.5,79 12.5,77.5 13,77 C41.- | 1,61.25 1,67 2.75,67 3,66.75 C37.- | R15.1 44.3,45.3 43.45,45.3 v42.9,45.27
  Top 1.016: R26.1 59.5,42.58 | 45.7,37.2 IC1.25 | 39.35,36.4 C15.2 | 33.5,38.5 34.5,37.5 35,37.5
  Top 1.27: R4.1 89.25,51.79 89.25,47 | D7.A 74.32,43.43 | D6.A 21.76,42.99 v21.75,42.75 | v37.25,27.25 39,26.5 | 45.7,37.2 45,36.5 39.6,36.5 C15.2 | 37.83,36.4 37.5,36.4 | 37.83,36.4 39.35,36.4 | D10.A 37.83,36.4 | D10.A 38.25,36.5 | 11.75,45.75 11.75,46 11.75,46.75 | 11,48.75 13.25,48.75 | 11.75,50.5 11.75,52 | 89.25,47 89.25,46.5 | 89.25,47 89,47.25 90.25,47.25 94,47.25 94.25,47.5 94.25,47 94.5,46.75 | 31.5,39.5 32.45,39.5 C11.2 32.52,39.48 33.5,38.5 | 35,37.5 36,36.5 D10.A | v7.5,40.75 8.25,40.75 11.25,43.75 13.5,43.75 v13.5,42.75 13.5,40.61 13.47,39.89
  Top 1.422: 14.18,46.7 14.17,47 14.15,50.7 | v30.5,39.5 31.5,39.5 | v27.5,39.5 v29,39.5
  Top 1.676: v29,39.5 v30.5,39.5
  Bottom 0.254: v21.75,42.75 21.75,42.66 21.7,42.61
  Bottom 0.813: v10.5,14.5 14.85,13.75 X1.B6 | X1.B5 X1.B6 | X1.B6 X1.B7 X1.B8
  Bottom 1.016: X1.A5 X1.B5 | X1.B6 X1.A6 | X1.B7 X1.A7 | X1.B8 X1.A8 | 43,45.25 v42.9,45.27
  Bottom 1.27: 72.5,44.75 59.58,44.7 v59.58,42.45 | v33,42.5 21.74,42.59 21.7,42.61 14.25,46.25 10.75,46.75 11.25,46.75 10.75,46.5 v10.5,46.75 | 72.5,44.75 v72.5,43 | v17.5,20.75 13.5,43 | v58,22.25 58,29 39,29 v37.25,27.25 34.5,27.25 30.5,31.25 v30.5,39.5 30.52,39.48 C11.2 34.75,41.75 34.75,43.75 36.25,45.25 43,45.25 | 72.5,44.75 90.25,44.75 92.5,46.75 v96.75,46.75
  Bottom 2.184: v30.5,39.5 v29,39.5 v27.5,39.5 21.25,39.5 13.5,43
  Bottom 2.54: v10.5,45.25 11.75,43 13.5,43
  other vias: 10.5,19.5 10.5,15.75 10.5,20.75 7.5,46.75 9,43.75 9,45.25 9,46.75 7.5,43.75 10.5,18.25 10.5,17 7.5,42.25 9,42.25 10.5,42.25 9,40.75 10.5,40.75 95.5,46.75 94.25,46.75
  pour Top: 48.95,73.1 14.95,73.1 6.25,64.5 6.25,53.75 14.5,53.75 14.75,53.5 14.75,43.2 0.5,43.25 0.5,70.25 6.75,70.25 9.5,73 9.5,79.25 9.25,79.5 50,79.5 50,74
  pour Bottom: 5,36 6.5,36 6.5,47.5 11.75,47.5 15.5,21.5 5,21.5
  pour Top: 49.25,79.5 90,79.5 90.38,73.2 93.12,70.45 99.5,70.5 99.38,44.83 87,44.75 86.97,54.12 93.47,54.12 93.5,64.5 85.5,72.5 57.5,72.5 57.25,72.75 55.5,73.25 49,73.25
  pour Top: 20.25,1.25 20.25,7.5 27.75,7.5 29,5.75 29,1.25
  pour Bottom: 19.5,1.25 19.5,7.5 29.75,7.5 29.75,1.25
  pour Bottom: 15.5,21.75 5,21.75 5,13.75 9.75,13.75 15.5,8 19.5,8 19.5,7 24,7 24,11 21,13.5 20.75,13.75 16.75,16.5
  pour Top: 7.25,22 7.25,14.5 13.5,8.25 19.25,8.25 21,7.25 25.25,7.25 22.5,10.25 21.75,11 20.5,12.5 11,22
  pour Top: 6.5,43.25 11.75,43.25 11.75,40 6.5,40
GND  (via drill 0.6)  (1 unrouted)
  Top 0.254: 33,9.5 31,9.5 v30.5,9 v29.25,9 v28,9
  Top 0.305: 88.7,42.7 87.75,41.75 87.75,40
  Top 0.406: 44.42,40.08 IC1.26 | 88.7,42.7 Q11.2 | 88.5,39.25 87.75,40 | 88.5,37.25 88.39,37.06 88.28,36.85 83.78,36.85 83,36.25 83,34.25 83.25,34 84.2,34 Q12.2
  Top 0.61: 32.1,11 33,11 C30.2 | JMP1.3 60.05,31.5 61,31.5 61.95,31.95 v61.92,37.8 61.5,38.45 JMP2.3 | 90.85,43 C13.2 89.05,42.9 Q11.2 | U$1.22 61.13,12.38 59.83,12.38 59.6,12.6 C32.2 56.92,12.1 | 68.58,18.77 68.27,18.36 68,18 | 69.98,18.77 U$1.8 | 72.84,18.75 C34.2 | C12.2 79.85,15.6 79.75,17 79.75,19.58 U$2.2 77.44,21.5 | 74.25,30 71.65,30 C20.2 | 74.25,30 76.75,30 77,30 | 78,30 79.5,30 79.85,29.41 80.56,28.19 IC6.7 82.44,25.05 Q13.2 83.65,24.85 85.5,23 87,23 87,23.15 R36.1 C14.2 | IC6.4 76.75,29.75 77,30 | IC6.13 74.21,30.04 74.25,30 | 77,30 78,30 | 78,30 78,33.05 IC6.10 | Q12.2 84.45,33.8 85,33.75 C35.2 R38.1 | 92.5,12.25 92.5,10.93 IC2.5 | IC2.5 92.42,12.66 92.5,12.75 85.4,12.75 C23.2 | IC2.8 96.22,9.47 95.75,9 93,9 92.5,9.5 92.5,10.76 IC2.5 | 38.25,9.6 C17.2 34.75,9.5 34.25,9 | 88.5,37.25 88.5,39.25 | 84.25,29.5 R43.1 | IC4.8 48.73,18.98 47.5,17.75 47.5,17.25 | 44.42,40.08 44.42,40.23 42.77,41.88 42.77,43.83 43.3,44.1 45.5,44.1 47.33,45.17 46.58,45.48 C36.2 | R23.1 88.55,36.9 88.39,37.06
  Top 0.813: 32.1,11 U$4.1 30.98,11 33,11 31.25,11 33,11 | 34.61,8.96 C31.2 35.15,9.5 33,9.5 | X1.B9 X1.A9 | X1.B10 X1.A10 | U$1.6 68.8,16.2 68,17 | C20.2 70.9,30.35 v69.75,31.5 71.25,30 76.75,30 IC6.4 | R38.1 84.25,29.5 79.94,29.5 79.85,29.41 | IC2.8 97.75,10.85 | C32.2 C43.2 | v47.5,13.25 47.5,17.25 | v37.88,11.18 38,9.9 C17.2 | IC1.20 52.05,40.54 51.95,40.64
  Top 1.016: U$3.1 25.54,8.96 | 68.58,18.77 69.98,18.77 | U$1.8 72.84,18.75 | C34.2 C19.2 75,20.25 v75.38,20.62 76.25,21.5 77.44,21.5 | X1.B11 X1.A11
  Top 1.27: 34.61,8.96 U$3.1 25.71,9 25.25,9 22.5,11.75 U$21.1 | 33,9.5 33,11 | 68,18 68,17 | 34.5,9 34.25,9 | 54.38,7.1 56.7,7.33 54.58,7.1 | v56.25,10.5 56.75,10.5 v57.58,10.5 | 85.1,12.6 C23.2 | 68.27,18.36 66.5,20.38 v66.5,24.5 v66.5,25.75 v66.5,27 | v67.75,29.5 v69.75,31.5 | 51.95,40.64 51.75,41.63 51,42.75 v51,43.6 v51,44.75 | v51,44.75 51.95,45.25 C1.2 C33.2 | v51,44.75 50.55,44.8 C8.2 47.02,45.85 C36.2
  Top 1.676: v57.58,10.5 56.92,12.1 | 34.5,9 34.62,7.1 54.38,7.1 | 56.7,7.33 56.75,10.5 | 85.1,12.6 82.33,7.1 54.58,7.1
  Bottom 0.61: v75.38,20.62 75.25,20.75 75.25,11 73.5,8.75 63.5,8.75 59,10.5 v57.58,10.5 | 61.83,38.05 61.85,38.05 | 61.85,38.05 61.8,38 | 61.85,38.05 v61.92,37.8
  Bottom 0.813: X1.A9 X1.B9 31.61,5.92 32.2,5.92 | 30.95,5.2 31,5.25 | 33.47,5.25 X1.B10 | v47.5,13.25 44.5,11.18 v37.88,11.18
  Bottom 1.27: U$3.1 25.46,8.96 | 31.25,8.97 31.45,8.72 | 31,5.25 33.47,5.25 | v69.75,31.5 70.25,32 | 70.25,37.5 62,37.5 61.83,38.05 | 51.65,40.98 51.95,40.64 51.86,40.64 51,41.5 v51,42.45 v51,43.6 v51,44.75
  Bottom 1.422: v56.25,10.5 v57.58,10.5 | v56.25,10.5 56,10.5 | 70.25,32 70.25,37.5 | v69.75,31.5 v68.75,30.5 v67.75,29.5 66.5,28 v66.5,27 v66.5,25.75 v66.5,24.5 66.5,20.5 v56.25,10.5 | 61.83,38.05 54.25,38.05 51.95,40.64
  Bottom 1.676: X1.B10 X1.A10 | X1.A9 30.95,5.2 | X1.A11 X1.B11 34.73,5.27 33,7 32.2,7
  Bottom 2.184: 25.46,8.96 31.25,8.97 32.2,8.02
  Bottom 2.54: 32.2,5.92 32.2,7 32.2,8.02
  pour Top: 29.75,6.25 29.75,1.25 36.75,1.25 36.75,8.25 27.25,9.75 27.25,8 28.25,8
N$1
  Top 0.61: 83.25,42.25 81.25,41.25 76.25,41.25 75.5,41.75 67.25,41.75 65.25,40.08 59.5,40.08 58.45,39.45 IC1.15 | Q4.4 79.84,48.23 80,48.07
  Top 0.813: 80,48.07 D4.A 80.79,46.71 83.25,44.25 83.25,42.25
N$2
  Top 0.61: U$1.7 77.41,17.48 U$2.3
N$3
  Top 0.61: Q3.4 63.56,49.66 63.5,49.6 65.92,49.62 66.61,48.94 D3.A 65.5,45.5 65.5,42.5 64,41 63.25,41 57.85,41.02 57.1,40.45 IC1.16
N$4  (via drill 0.6)
  Top 0.61: v78,24.25 78,26.91 IC6.5
  Bottom 0.61: X1.A28 80.5,3.77 80.5,21.75 v78,24.25
N$5  (via drill 0.6)
  Top 0.61: 79.84,57.34 Q4.5 Q4.6 Q4.7 Q4.8 76.03,57.22 | 77.28,55.27 77.3,55.27 77.3,56.27 78.58,56.27 78.58,55.38
  Top 1.27: D11.C 73.5,57.25 U$18.1
  Bottom 2.54: 85.5,61.75 86.5,78.45 51.75,78.45 X2.P$2
  other vias: 75.75,57 78.75,57 77.25,57 80.25,58.5 80.25,57 75.75,58.5 77.25,58.5 78.75,58.5 80.25,60 75.75,60 77.25,60 78.75,60 75.75,61.5 77.25,61.5 78.75,61.5 80.25,61.5 75.75,63 77.25,63 78.75,63 80.25,63
  pour Top: 74.25,56.75 81.25,56.75 81.25,54.52 74.25,54.52
  pour Bottom (no thermals): 70.5,53.25 70.5,65.75 81.75,65.75 81.75,79.5 90.5,79.5 90.5,72.75 90.25,72.5 90.5,72.5 92.75,70.25 99.5,70.25 99.25,53.25
  pour Top (no thermals): 71.62,64.5 71.62,54 75.25,54 75.25,56.25 80.75,56.25 80.75,54.5 84.25,54.5 84.25,63.25 83,64.5
N$6  (via drill 0.6)
  Top 0.61: R29.2 R9.2 17.32,50.2 | 17.62,50.23 R3.2 | v19.75,49.25 19.45,49.55 19.45,49.72 19.45,50.2 v19.75,50.5 v19.75,51.75
  Top 0.813: 36.23,49.75 Q1.1 | 15.57,46.42 15.57,50.67
  Top 1.016: v34.83,49.75 36.23,49.75 | 19.45,49.72 Q2.1
  Top 1.676: v32.27,49.75 v33.58,49.77 v34.83,49.75
  Bottom 1.27: v32.27,49.75 32,50.5 31.75,50.5
  Bottom 3.81: v19.75,50.5 31.75,50.5 34.5,50.5
  pour Top: 15.25,53.25 19.5,53.25 20.75,52 20.75,48.75 19.6,48.75 19.6,41.5 15.25,41.5
N$7  (via drill 0.6)
  Top 0.61: 59.7,57.55 Q3.8 Q3.7 Q3.6 Q3.5 63.51,57.51 | 60.98,55.3 60.98,56.3 62.23,56.3 62.23,54.98 62.25,54.98 62.25,55
  Top 0.813: 69.75,61.75 70,61.75
  Top 1.27: D11.A 70.03,61.75 69.75,61.75 66.5,61.75 U$15.1
  Bottom 2.54: X2.P$1 55.25,75.5 66.25,75.5 66.25,62
  other vias: 59.25,57 62.5,57 60.75,57 64,58.5 64,57 59.25,58.5 60.75,58.5 62.5,58.5 62.5,60 59.25,60 60.75,60 64,60 59.25,61.5 60.75,61.5 62.5,61.5 64,61.5 59.25,63 60.75,63 62.5,63 64,63
  pour Top: 58,56.5 65,56.5 65,54 58,54
  pour Bottom (no thermals): 51.5,68.25 56.95,68.25 56.95,73.9 64.65,73.9 64.65,68 67.85,67.9 67.85,76.78 81.25,76.8 81.25,66.25 70,66.25 70,53.25 51.5,53.25
  pour Top (no thermals): 55.5,54 58.75,54 58.75,56.25 64.75,56.25 64.75,54 68.5,54 68.5,64.5 55.48,64.53
N$8
  Top 0.61: Q2.4 25.25,49.63 27.12,49.63 28.25,48.5 28.25,47 D2.A 28.22,45.97 27.1,44.5 27.1,41.45 27.35,41.1 36.67,41.12 37.33,39.5 41.58,39.5 41.88,39.45 IC1.28
N$9  (via drill 0.6)
  Top 0.254: 20.5,54.75 20.55,54.8 | 30.55,57.67 30.55,57.42 D12.C
  Top 0.406: Q2.8 21.36,56.15 21.25,56.25 21.17,57.75 | Q2.5 25.16,56.09 25,56.25 24.71,57.75
  Top 0.61: 21.38,56.1 21.35,56.1 21.35,54.85 22.68,54.85 22.68,54.83 22.62,54.83 22.62,56.23 23.9,56.23 23.9,54.9 25.15,54.9 | 25.15,54.9 25.15,54.85 | 25.15,54.9 25.15,56.23
  Top 0.813: Q2.8 Q2.7 Q2.6 Q2.5
  Top 1.27: 30.55,57.42 27,57.42 27,57.5
  Bottom 0.254: 10.5,51 17.25,51 17.25,54.5
  Bottom 2.54: 14,62.25 14,78.25 48.25,78.25 X2.P$3
  other vias: 20.75,58.5 23.75,57 20.75,57 22.25,57 25.25,57 23.75,58.5 22.25,58.5 25.25,58.5 23.75,60 20.75,60 22.25,60 25.25,61.5 25.25,60 23.75,61.5 22.25,61.5 20.75,61.5 20.75,63 22.25,63 23.75,63 25.25,63
  pour Top: 20,56.75 20,54 26.25,54 26.25,56.75
  pour Top (no thermals): 15.97,54.02 19.98,54.02 20.25,56.5 26,56.5 25.98,53.95 29.2,53.95 29.23,64.45 17.25,64.42 16,63.25
  pour Bottom (no thermals): 15.75,53 30.25,53 30.25,66 20.75,66 20.75,79.4 9.75,79.4 9.75,79.25 9.5,79.25 9.5,72.75 6.5,70.25 1,70.25 0.62,69.67 0.62,60.42 15.75,60.5
  pour Bottom (no thermals): 6.5,54.25 6.5,48 17.5,48 17.5,51.5 20,54 16.5,54 16.25,54.25
N$10  (via drill 0.6)  (1 unrouted)
  Top 0.61: Q1.2 37.5,49.68 37.5,47.06 37.47,47.03 | 37.47,47.03 D5.C | 37.47,47.03 37.25,46.75 37.75,46.75 37.75,41.25 38.05,40.95 v38.05,40.7 | 36.07,47.15 R25.2 | v37.9,31.7 38.08,31.57 39.33,30.43 41.71,30.43 IC1.1
  Top 0.813: D5.C 36.07,47.15
  Bottom 0.813: v38.05,40.7 38.08,40.7 38.33,40.45 38.33,32.1 v37.9,31.7
N$11
  Top 0.61: Q1.4 40.22,49.47 40.25,49.2 40.25,47.05 D1.A 39.66,46.03 38.62,44.62 38.62,41.75 39,41.42 41.85,41.42 43.1,40.1 IC1.27
N$12  (via drill 0.6)
  Top 0.61: 40.08,57.58 Q1.5 Q1.6 Q1.7 Q1.8 36.27,57.48 | 37.5,55.5 37.55,55.5 37.55,56.2 38.83,56.2 | 38.83,56.2 38.85,56.2 | 38.83,56.2 38.83,55.3 38.75,55.3 38.75,55.25
  Top 1.27: D12.A 34,61.65
  Bottom 2.54: X2.P$4 44.75,75.25 36.5,75.25 36.5,62
  other vias: 36.25,57 37.75,57 40.75,57 39.25,57 37.75,58.5 36.25,58.5 36.25,60 39.25,58.5 40.75,58.5 37.75,60 39.25,60 40.75,60 36.25,61.5 37.75,61.5 39.25,61.5 40.75,61.5 36.25,63 37.75,63 39.25,63 40.75,63
  pour Top: 35,54 41.25,54 41.25,56.75 35,56.75
  pour Bottom (no thermals): 31,53 36,53 37.5,51.25 37.5,48.75 48,48.75 48,66 42,66 41,67.25 34.5,67.25 33,65.75 33,65 31,62.75
  pour Bottom (no thermals): 21.25,76.5 34.75,76.5 34.75,66.75 38.25,66.75 38.25,73.5 43,73.5 43,68.25 48,68.25 48,62 31,62 31,66.5 21.25,66.5
  pour Top (no thermals): 32.25,54 32.25,64.5 44.25,64.5 44.25,54 41.25,54 41.25,56.75 35.5,56.75 35.5,54
N$13
  Top 0.406: IC1.2 43.16,28.86 42.6,28.35 41.3,28.35 40.75,28.9 40.75,29.25
  Top 0.61: 22.62,48.12 Q2.2 | 22.62,48.12 22.75,48 23,48 D6.C | D6.C 24.47,46.7 | D6.C 24.01,46.74 26.1,45.02 26.1,41.12 25.85,40.88 25.85,39.27 27.4,37.6 32.65,37.6 34.75,35.75 34.75,32 35.5,31 37,31 38.5,29.5 40.5,29.5 40.75,29.25 | R24.2 22.15,47.65 22.62,48.12
N$14
  Top 0.61: IC1.4 45.7,27.95 43.5,24.5 43.25,24.25 | R21.1 40.5,18.5 41.5,20 43.25,20 43.25,24.25 | 43.25,24.25 41.6,24.25 C7.1
N$15  (via drill 0.6)
  Top 0.61: v64.25,39 64.22,37.25 64.22,31 60.75,28.25 57.75,28.25 57.12,28.88 IC1.13 | Q4.2 77.31,48.8 76,47.5 | 76,47.5 75.08,47.5 D7.C | D7.C 74.76,46.99 | v77.05,42.4 77.05,44.52 76,45.75 76,47.5 | R27.2 74.73,46.9 D7.C
  Bottom 0.61: v77.05,42.4 73.75,39 v64.25,39
N$16  (via drill 0.6)
  Top 0.61: R30.2 19.45,23.95 v20.5,24.62 | v36,24.62 v36,28.85 | 39.55,33.4 C15.1 39.9,33.5 | v68.72,36.05 71.98,35.61 | 71.98,35.61 v72.01,35.61 | v72.01,35.61 R33.2 | IC1.22 49.3,39.2 49.25,39.25 | v72.01,35.61 71.99,35.61 71.98,35.61
  Top 1.016: 39.55,33.4 D10.C | v39.75,31.75 C15.1 | 39.9,33.5 44.5,33.5 48.23,37.23 IC1.23 48.28,39.25 49.25,39.25
  Bottom 0.61: v20.5,24.62 v36,24.62 | v36,28.85 v39.75,31.75 45.25,31.75 50.23,36.05 v68.72,36.05 | X1.B30 84.29,5.29 86,7 86,12.25 89.75,25.75 89.75,35.25 86,38 75.66,38 v72.01,35.61
N$17  (1 unrouted)
  Top 0.61: 54.65,39.37 54.65,40.3 55.75,41.52 56.33,41.52 56.67,41.55 57.1,42.52 57.1,45.98 57.08,46.9 56.2,47.98 53.48,48 53.38,48.1 | R10.1 47.75,48.6 48.25,47.5 49,46.25 50.75,46.25 52.35,47.35 53.38,48.1 | 53.38,48.1 53.38,48.15 R1.1
N$18
  Top 0.61: IC5.6 14.79,28.71 15.25,28.25 15.25,24 | 15.25,24 13.65,24 R46.2 | 15.25,24 15.7,24 R30.1
N$19
  Top 0.61: IC1.7 49.51,27.84 51.77,25.57 SV1.3 51.77,22.29 SJ5.2
N$20
  Top 0.406: 44.42,28.98 44.42,29.5 IC1.3
  Top 0.61: 44.42,29.5 44.4,29.32 44.4,28.65 42.52,26.77 C16.1 41.5,26.75 39.75,28.5 38,28.5 36.5,30 34.75,30 33.75,31.5 33.75,33 33.5,33.25 33.5,35.25 32.4,36.35 Q6.C Q7.C 27.15,36.35 24.5,39 18.85,39 R29.1
N$21
  Top 0.61: R16.2 32.4,34.1 Q6.E
N$22  (via drill 0.6)
  Top 0.61: Q9.C Q8.C 23.6,36.35 23.5,36.25 v23.5,37.25 | IC1.12 55.85,28.55 56.2,27.8 57.25,27 58.4,26.25 C42.1 | C42.1 58.3,26.9 60.77,26.98 63.08,28.65 65.25,30.5 65.25,37.75 67.5,40 R31.1 | v56.25,27.5 58.1,26.25 C42.1
  Bottom 0.61: v23.5,37.25 24.5,37.25 31.5,25.75 36.75,25.75 37.75,25 43.5,25 45.75,27.5 v56.25,27.5
N$23
  Top 0.61: Q7.E 29.2,33.95 27.75,32.5 27.75,29.9 R17.2
N$24
  Top 0.61: JMP1.2 55.5,33.25 55,32.42 54.6,31.52 54.6,30.02 IC1.11
N$25
  Top 0.305: 17.55,34.3 18.5,35.25 21,35.25 24.2,35.25 27.3,35.25 30.25,35.25
  Top 0.406: Q5.B 17.55,34.3 | 30.25,35.25 30.5,35 30.5,34.2 Q6.B | 27.3,35.25 Q7.B | Q8.B 24.05,35.1 24.2,35.25 | Q9.B 20.8,35.05 21,35.25
  Top 0.61: IC5.7 16,31.96 16,32.75 16.15,32.75 Q5.B
N$26
  Top 0.61: Q8.E 25.95,31.7 R19.2
N$27
  Top 0.61: Q9.E 22.7,33.85 R20.2
N$28
  Top 0.61: 46.97,40.13 IC1.24
  Top 0.813: 46.97,40.13 46.97,40.53 46.25,41.25 45.5,41.25 44.5,42.25 44.5,42.73 R15.2
N$29
  Top 0.61: R16.1 29.6,29.05 R12.2
N$30
  Top 0.61: R19.1 23.35,29.3 R18.2
N$31
  Top 0.61: R12.1 29.75,25.95 29.5,25.7 29.3,25.7 28.4,24.65 27.1,24.65 26.7,24.2 26.7,23.31 IC3.4
N$32
  Top 0.61: R17.1 26.75,25.75 25.4,24.4 25.4,23.28 IC3.5
N$33
  Top 0.61: R18.1 23.75,25.45 24.1,25.1 24.1,23.28 IC3.6
N$34
  Top 0.61: IC3.7 22.84,24.41 20.75,26.5 R20.1
N$35  (via drill 0.6)
  Top 0.61: 49.51,20.49 SJ6.1 49.24,20.49 45.75,17.75 45.75,12.38 47.77,11.35 49.97,11.35 | 49.97,11.35 IC4.2 | U$1.15 58.78,21.29 58.2,20.73 57.97,20.5 v57.75,20.5 | 49.97,11.35 51.38,11.35 v51.48,11.28
  Bottom 0.61: v51.48,11.28 52.5,12.25 57.75,18.25 v57.75,20.5
N$36  (via drill 0.6)
  Top 0.61: IC3.3 27.93,21.32 30.5,18.75 v32.25,18.75 | IC4.3 51.52,12.62 v51.6,14.47 51.62,17.93 51.88,18.77 v52,19 52.02,19.21 SJ5.1 | v56.25,19 58.25,19 59.25,20 61.13,20 U$1.16
  Bottom 0.61: v32.25,18.75 36.83,14.53 v51.6,14.47 | v52,19 v56.25,19
N$37  (via drill 0.6)
  Top 0.61: IC3.1 30.49,21.26 v32.25,20.25 | 53.4,17.75 v52.75,15.95 52.77,10.75 52,10.1 49.81,10.1 IC4.1 | 53.4,17.75 SJ8.1 | U$1.17 59.74,18.75 59,17.75 53.4,17.75
  Bottom 0.61: v32.25,20.25 34.25,20.25 40,16 v52.75,15.95
N$38  (via drill 0.6)
  Top 0.61: IC3.10 22.84,15.6 v22.82,15 | v58.75,9 59.35,11.12 U$1.23
  Bottom 0.61: v22.82,15 23.23,15.53 32.48,15.53 37.75,9 v58.75,9
N$39  (via drill 0.6)
  Top 0.61: IC3.2 29.2,24.2 29.75,24.75 31.25,24.75 v32.25,22.25 32.75,24.5 R6.1 | v44.5,20.5 46.69,20.5 SJ7.1
  Bottom 0.61: v32.25,22.25 35,22.25 38.5,20.5 v44.5,20.5
N$40
  Top 0.61: IC1.17 55.85,37.49 56.75,36.75 JMP2.2
N$41  (via drill 0.6)
  Top 0.61: IC6.9 79.29,31.71 79.75,31.25 81.5,31.25 v82,30.75
  Bottom 0.61: v82,30.75 82.75,30 82.75,8.52 X1.B29
N$42
  Top 0.61: 50.2,56.7 50.2,60.7
  Top 0.813: 78.6,49.79 Q4.3 | 62.25,52.25 62.23,51.73 | 23.89,51.65 24,52.25 | 39,52.25 38.8,51.55 | 52.5,52.25 52.5,50.7 52.38,50.38 47.17,50.38 R10.2
  Top 1.27: 78.6,52.25 78.6,49.79 | 62.23,51.73 Q3.3 | Q2.3 23.89,51.65 | 38.8,51.55 Q1.3 | R5.1 52.05,52.45 52.5,52.25
  Top 2.54: 24,52.25 39,52.25 52.5,52.25 62.25,52.25 78.6,52.25
  pour Top: 50,63.5 50,51.75 53.5,51.75 55,52 55,63.5
N$43
  Top 0.61: R7.1 95.73,43.02
  Top 0.813: 95.73,43.02 JP2.1
N$44
  Top 0.813: JP2.2 96.16,40.48 R32.2
N$45  (via drill 0.6)
  Top 0.61: Q3.2 61,49.68 61,48.5 61,47.25 | v60.98,42.9 61,45.75 61,47.25 | R26.2 60.92,47.17 61,47.25 | v63,39 63,31.5 60.75,29.75 58.5,29.75 58.5,30.5 58.4,30.39 IC1.14
  Top 0.813: 62.22,47.28 D8.C
  Top 1.016: 61,48.5 62.22,47.28
  Bottom 0.61: v63,39 63,40.05 v60.98,42.9
N$46
  Top 0.61: IC6.2 74.21,28.04 73.5,28.75 70.75,28.75 69.58,28.2 65.58,28.2 62.98,25.82 62.98,22.57 61.17,22.57 U$1.14
N$47
  Top 0.61: R21.2 37.5,18 37.25,17.5 34,17.5 34,20.6 Q10.3
N$48
  Top 0.61: R14.1 86.38,41.6 Q11.3
N$49
  Top 0.61: C6.2 35.5,18.95 Q10.1 D9.C
N$50
  Top 0.61: IC5.2 IC5.1
N$51
  Top 0.61: R28.2 40.12,13.1 41.7,13.93 43.55,13.93 IC4.13
N$52
  Top 0.61: R28.1 35.88,15.9 C6.1
N$53
  Top 0.61: IC5.9 IC5.8
N$54
  Top 0.61: IC5.13 IC5.14
N$55
  Top 0.61: R33.1 76.65,35.85 76.75,34.75 IC6.11
N$56
  Top 0.61: IC1.9 52.05,28.95 53,28 53.5,28 56.98,25.25 60.5,25.25 66.25,30 66.25,35 68.5,38 78.75,38 R13.1 R14.2
N$57
  Top 0.61: R45.2 13.55,27.17 IC5.5 13.52,33.27 15.5,35.25 16.57,35.25 17.57,36.25 18.4,36.25 Q5.C
N$58  (via drill 0.6)
  Top 0.61: U$1.10 73.53,21.29 v74.25,22 | v81.62,33.58 80.5,33.13 IC6.8
  Bottom 0.61: v74.25,22 71.75,24.75 71.75,26.25 v81.62,33.58
N$59
  Top 0.61: R11.2 17.75,32 19.5,33.75 19.5,34.1 Q5.E
N$60
  Top 0.61: IC6.6 79.29,24.04 78.75,23.2 73.8,23.2 72.88,22.57 70.17,22.57 U$1.11
N$61  (via drill 0.6)
  Top 0.61: SJ4.2 SJ3.2 SJ2.2 SJ1.2 86.24,21.01 83.33,23.68 v81.5,23.68 | U$1.9 70.14,20 68.75,20 68,20.75 68,24.25 70.68,26.93 IC6.1 72.95,26.74 v72.92,25.32
  Bottom 0.61: v72.92,25.32 79.7,25.32 v81.5,23.68
N$62
  Top 0.61: IC2.15 88.61,18.14 87.75,19 87.75,19.24 SJ1.1
N$63
  Top 0.61: IC2.14 89.88,19.36 SJ2.1
N$64
  Top 0.61: IC2.13 91.14,19.13 SJ3.1
N$65
  Top 0.61: IC2.12 92.42,17.9 SJ4.1
N$66
  Top 0.61: X1.B31 86.83,6.83 87.9,8.35 88.6,9.3 88.65,9.75 88.65,10.99 IC2.2
N$67
  Top 0.61: X1.B32 89.5,5.27 91.15,7.7 91.12,10.83 IC2.4
N$68
  Top 0.61: X1.A31 86.83,3.08 88.12,4.28 88.12,6.53 88.5,7 89.83,8.3 89.85,9.53 89.85,10.82 IC2.3
N$69
  Top 0.61: IC2.1 87.27,9.57 85.58,7.6 85.58,4.19 X1.A30
N$72  (via drill 0.6)
  Top 0.61: IC6.3 75.48,24.3 v75.45,24.27
  Bottom 0.61: v75.45,24.27 75.45,23.3 77.92,21.45 77.92,6.5 78.66,5.77 X1.B28
N$73  (via drill 0.6)
  Top 0.61: IC6.12 75.48,36.98 75.5,37 78.25,37 v78.72,34.98 | R43.2 84.2,31.73 84.1,31.93 v82.2,32.3
  Bottom 0.61: v78.72,34.98 81.47,34.98 84,33.25 | v82.2,32.3 83,33.25 84,33.25 | 84,33.25 84.25,33 84.25,7.31 83.81,6.81 83.03,6 83.03,3.98 X1.A29
N$74
  Top 0.61: Q11.1 90.05,40.8 C13.1
  Top 0.813: C13.1 92.7,40.12 R32.1 92.85,37 R23.2 93.12,36.73 D13.A
N$75
  Top 0.61: C31.1 35.15,12.5 U$4.2
  Top 1.016: X1.B13 X1.A13 | X1.B12 X1.A12
  Top 1.27: U$4.2 28.5,12.5 27.5,11.5 U$3.2
  Bottom 1.676: X1.A13 X1.B13 X1.B12 | X1.B12 X1.A12 | X1.B12 38.57,6.43 37.73,7.33 36.73,7.33 36,8
  Bottom 2.184: 36,8 33.25,11.5 U$3.2
  pour Top: 37.25,6 42.25,6 42.25,1.25 37.25,1.25
N$76  (via drill 0.6)
  Top 0.813: v98,34.75 98,36.45 D13.C
  Bottom 0.61: v98,34.75 95.75,33.5 95.75,11.25 91,6.5 91,4.36 X1.A32
N$77  (via drill 0.6)
  Top 0.61: U$1.2 71.12,11.12 72.25,10.25 72.85,10.25 R35.1 72.75,9.75 v72.5,10 | v87.95,34.62 86.45,34.7 86.75,34.75 86.75,34.65 Q12.3
  Bottom 0.61: v72.5,10 72.25,10 69.25,14.5 69.25,27.25 76.75,37 84.25,37 v87.95,34.62
N$78
  Top 0.61: U$1.3 71.11,12.39 72.25,11.75 79.1,11.75 R34.1
N$79  (via drill 0.6)
  Top 0.61: U$1.4 72.44,13.66 R37.1 v72.5,13.5 | v86,24.25 85.75,26.1 Q13.3
  Bottom 0.61: v72.5,13.5 72.5,18 70.5,24.5 70.5,26.75 77.75,36 83.25,36 85.75,34 v86,24.25
N$82
  Top 0.61: R42.1 90.9,32.5 C35.1 | R38.2 C35.1 | Q12.1 84.45,35.7 84.5,36 88.5,36 89.75,34 90.5,32.9 C35.1
N$83
  Top 0.61: JP1.2 95.67,32.52 R42.2
N$84
  Top 0.61: JP1.1 96.13,29.98 R41.1
N$85
  Top 0.61: C14.1 R40.1 | C14.1 R36.2 | Q13.1 85.7,27.45 86.47,28.1 89.38,28.1 C14.1
N$86
  Top 0.61: R40.2 98.23,26.5 JP3.2
N$87
  Top 0.61: R39.1 98.02,23.75 JP3.1
N$88
  Top 0.61: IC1.6 48.23,26.59 49.2,25.62 49.2,24.53 SV1.2 49.23,22.03 SJ6.2
N$89
  Top 0.61: IC1.5 46.97,24.77 SV1.1 46.69,22.02 SJ7.2
N$90
  Top 0.61: IC1.8 50.77,28.68 54.3,25.15 SV1.4 54.31,22.1 SJ8.2
N$91  (via drill 0.6)
  Top 0.254: 84.5,52.25 85.8,53.83
  Top 0.61: R4.2 84.55,41.3 82.5,40.25 73.4,40.25 R31.2 | C10.1 84.85,49.75 84.6,49.5 | 85.8,53.83 83.3,53.83 | 86.25,48.5 86.25,51.25
  Top 0.813: 84.59,49.59 R4.2 | 76,49.75 Q4.1 | 59.66,49.75 Q3.1
  Top 1.016: 74.75,49.75 76,49.75 | v58.25,49.75 59.66,49.75
  Top 1.27: v74.25,49.75 74.75,49.75
  Top 1.422: R8.2 84.6,49.5 84.6,48.64 R4.2 | 84.59,49.59 v81.75,49.5 v81.75,50.75
  Top 1.676: v71.25,49.75 v72.75,49.75 v74.25,49.75 | v58.25,49.75 v57,49.75 v55.75,49.75
  Bottom 0.813: 73.75,50.75 v71.25,49.75
  Bottom 1.27: v55.75,49.75 56.5,50 56.5,50.75
  Bottom 3.81: 56.5,50.75 73.75,50.75 v81.75,50.75
  other vias: 81.75,52
  pour Top: 80.75,54 80.75,48.75 82.25,48.75 82.25,46.5 84.25,44.5 86.5,44.5 86.5,54 82,54
VCC  (via drill 0.6)
  Top 0.254: 49.08,42.02 49.33,42.17 49.5,42
  Top 0.61: IC3.15 IC3.16 30.38,16.87 28.5,18.75 20.5,18.75 | 12.4,22 12.65,21.75 14.88,21.75 | R11.1 17.75,25.75 17.15,25.25 17.15,22.25 17,22 12.65,22 | 12.4,22 12.65,22 | 12.65,22 12.15,22.25 | 12.4,22 12.15,22.25 | 32.6,14 33,14 | 50.75,37.52 50.75,37.74 IC1.21 | JMP2.1 JMP1.1 | IC5.4 12.03,29.57 C18.1 12.15,22.25 | R6.2 33.35,28.9 34.75,27.5 34.75,24.4 v33.92,23.57 | C9.1 19.9,18.75 20.5,18.75 | 20,18 20.5,18.75 | IC4.16 IC4.15 IC4.16 41.52,10.1 C17.1 | 41,9.5 C17.1 | C30.1 34.38,14.15 | C32.1 58.8,15.4 59.25,14.95 61.13,14.95 U$1.20 | 72.5,15.75 72.65,15.75 C34.1 | U$2.1 U$2.4 82.61,15.96 C12.1 82.65,14.7 82.2,13.75 | C19.1 75,15.5 | 77.25,14.35 R37.2 77.5,13.75 82.2,13.75 | R34.2 79.35,9.75 R35.2 81.75,9.75 81.75,13.8 82.2,13.75 | C20.1 71.25,33.25 72.76,33.25 IC6.14 | R39.2 92.75,23.85 93.1,23.85 94.25,25 94.25,28.25 94.1,28.25 R41.2 92.85,29.6 94.25,31 94.25,34.25 94.12,34.38 94.5,34.75 95.75,34.75 96.58,35.5 96.58,38.45 94.25,38.45 94.25,41.5 | IC2.6 93.69,13.56 93.25,14 85.75,14 85.38,15.12 86,15.25 85.4,15.25 C23.1 86.84,16.99 IC2.16 | C32.1 59.1,15.4 59.5,15 | C17.1 41.4,8.85 | IC1.10 53.25,30 53.25,35 | U$1.21 59.98,13.66 C32.1 | 58.95,35 58.5,35 v58.25,34.75 | 57.5,35 57.25,35 v57,34.75
  Top 0.813: U$3.3 25.79,14.04 26.25,14.5 | 29.98,14.5 30.61,14.37 | C12.1 85.15,15.5 C23.1 | C20.1 69.75,33.75 v67.75,34.75 | R39.2 92.85,22.9 93.75,22.07 96.25,22.07 97.5,19.5 | 97.5,19.5 97.5,15 86.25,15 85.38,15.12 | C38.1 98.25,18.75 97.5,19.5 | 49.5,42 50.1,41.48 50.27,41.3 | R7.2 92.88,42.88 94.25,41.5
  Top 1.016: 50.27,41.3 50.6,40.12 50.6,37.9 50.75,37.74 | 18.45,17.5 20,18 | 41,9.5 39.5,11.25 38.75,12.25 37.98,14.15 | U$1.5 71.69,14.94 72.5,15.75 | C34.1 C19.1 | 75,15.5 76.75,15.5 77.25,14.35 | 50.75,37.5 50.75,37.52 | 58.95,35 JMP2.1
  Top 1.27: 32.6,14 U$4.3 30.61,14.37 30.46,14.52 | 29.98,14.5 v28.5,14.5 26.25,14.5 v23.5,13.5 21.88,13.49 18.45,17.5 v17.5,17.5 16.5,18.75 14.88,21.75 | U$1.20 U$1.5 | 33,14 C30.1 | 34.38,14.15 37.98,14.15 | 59.5,15 64.5,15 | C32.1 C43.1 54.08,13.97 54.1,10.3 52.5,8.85 41.4,8.85 | C36.1 49.08,42.02 C8.1 | v55.77,34.85 57.5,35
  Top 1.422: 64.5,15 v64.5,22.75 v64.5,24 v64.5,25.25 | 53.25,35 50.75,37.5
  Top 1.676: 53.25,35 57.5,35 58.95,35
  Bottom 0.61: v33.92,23.57 30.82,23.57 24.75,17.5 v17.5,17.5
  Bottom 0.813: 64.45,34.73 v67.75,34.75
  Bottom 1.016: v28.5,14.5 26.5,14.5 26.25,14.25
  Bottom 1.27: 56.08,34.73 v55.77,34.85 | v23.5,13.5 26.25,14.25
  Bottom 1.422: v64.5,22.75 v64.5,25.25 64.45,34.73 56.08,34.73